# Altium schematic sheet Control Board 2.SchDoc
size A4; SheetNumber: 1; SheetTotal: 2
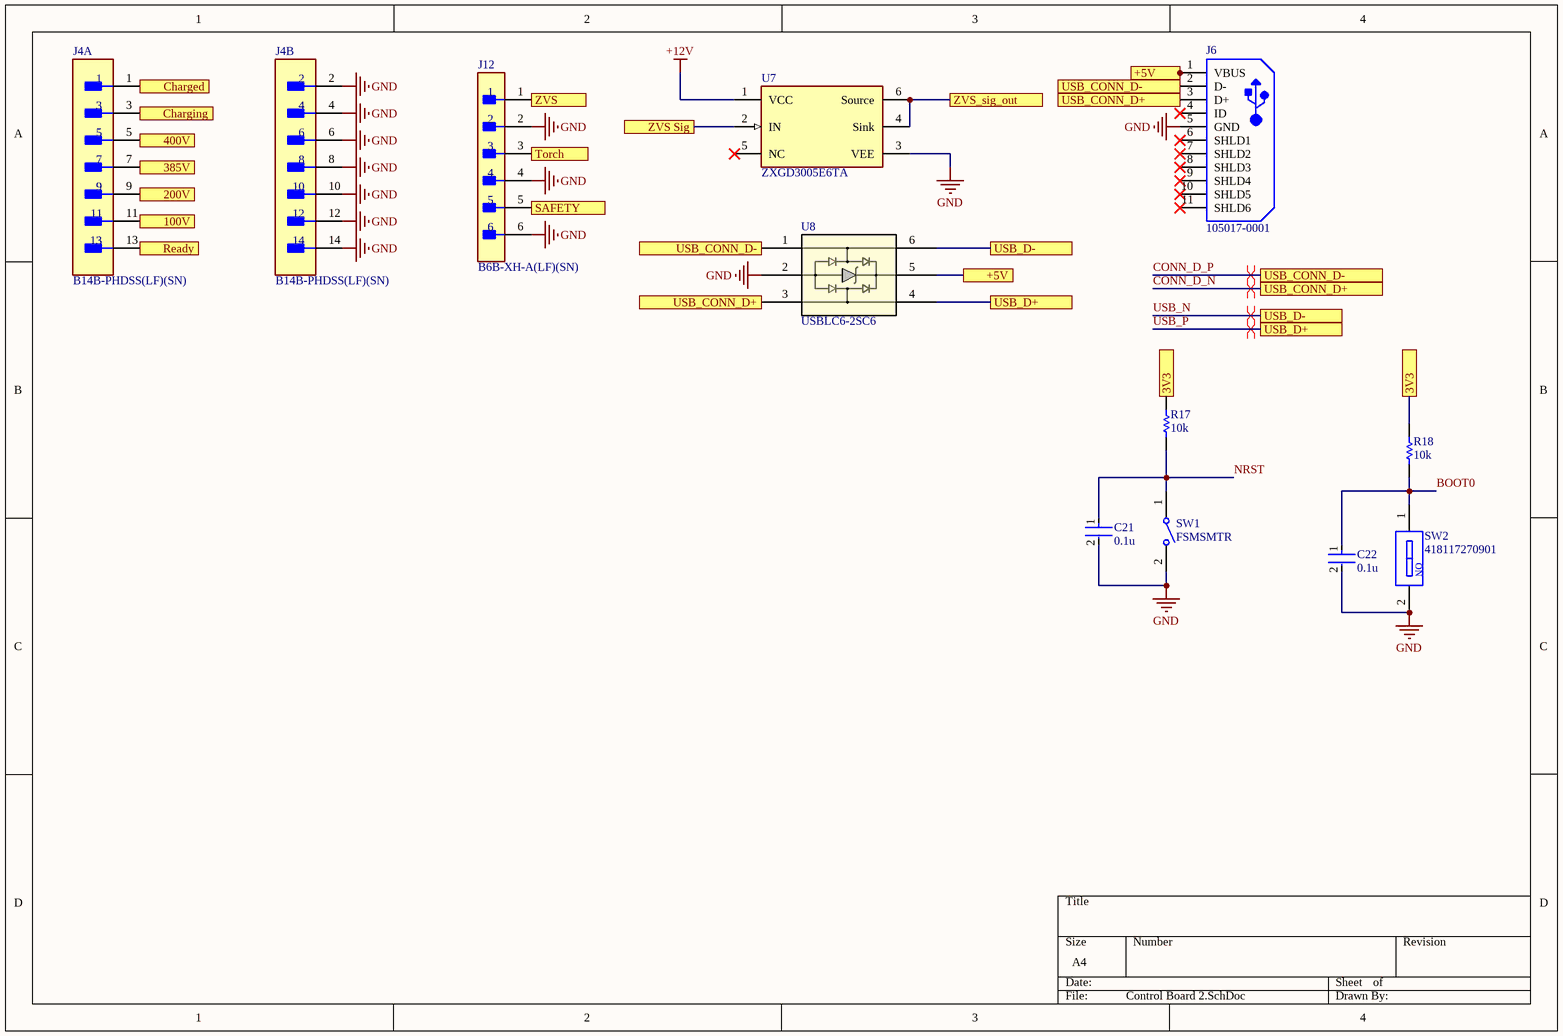
[diagram p0: Control Board 2.SchDoc]

## Parts
C21  0.1u  [FP-GRM188-0_1-e0_2_0_55-IPC_A]
C22  0.1u  [FP-GRM188-0_1-e0_2_0_55-IPC_A]
J4  B14B-PHDSS(LF)(SN)  [FP-B14B-PHDSS_LF_SN-MFG]  (parts A,B of 2)
J6  105017-0001  [USB-MICRO-B_V]
J12  B6B-XH-A(LF)(SN)  [FP-B6B-XH-A_LF_SN-MFG]
R17  10k  [RESC1609X50X30NL8T20]
R18  10k  [RESC1609X50X30NL8T20]
SW1  FSMSMTR  [TECO-FSMSMTR_V]
SW2  418117270901  [418117270901]
U7  ZXGD3005E6TA  [FP-SOT26_SC74R-MFG]
U8  USBLC6-2SC6  [SOT23-6L_STM]

## Ports
3V3, 100V, 200V, 385V, 400V, +5V, Charged, Charging, Ready, SAFETY, Torch, USB_CONN_D+, USB_CONN_D-, USB_D+, USB_D-, ZVS, ZVS Sig, ZVS_sig_out

## Nets
+12V: U7.1(VCC)
GND: C21.2 C22.2 J4.2 J4.4 J4.6 J4.8 J4.10 J4.12 J4.14 J6.5(GND) J12.2 J12.4 J12.6 SW1.2 SW2.2 U7.3(VEE) U8.2
3V3: R17.1 R18.1 ; port 3V3
100V: J4.11 ; port 100V
200V: J4.9 ; port 200V
385V: J4.7 ; port 385V
400V: J4.5 ; port 400V
+5V: J6.1(VBUS) U8.5 ; port +5V
BOOT0: C22.1 R18.2 SW2.1
Charged: J4.1 ; port Charged
Charging: J4.3 ; port Charging
CONN_D_N: J6.3(D+) U8.3 ; port USB_CONN_D+
CONN_D_P: J6.2(D-) U8.1 ; port USB_CONN_D-
NRST: C21.1 R17.2 SW1.1
Ready: J4.13 ; port Ready
SAFETY: J12.5 ; port SAFETY
Torch: J12.3 ; port Torch
USB_N: U8.6 ; port USB_D-
USB_P: U8.4 ; port USB_D+
ZVS: J12.1 ; port ZVS
ZVS Sig: U7.2(IN) ; port ZVS Sig
ZVS_sig_out: U7.4(Sink) U7.6(Source) ; port ZVS_sig_out

Not connected (* = marked no-connect by the designer): J6 4(ID)* 6(SHLD1)* 7(SHLD2)* 8(SHLD3)* 9(SHLD4)* 10(SHLD5)* 11(SHLD6)*; U7 5(NC)*

## Layout directives
differential pair: CONN_D_N, CONN_D_P, USB_N, USB_P

## Notes on the sheet
- (in symbol CMP-1435-00001-2) ON

## Library data of the parts
C21 C22 = CMP-2006-02792-2: Chip Multilayer Ceramic Capacitors for General Purpose, 0603, 10uF, X5R, 15%, 20%, 6.3V; Packaging: Tape and Reel; Voltage Rating (DC): 6.3V; Width: 0.031inch; Termination: SMD/SMT; Dielectric: X5R; Package Quantity: 4000; Voltage Rating: 6.3V; Capacitance: 10uF; Case/Package: 0603; Min Operating Temperature: -55°C; Voltage: 6.3V; Length: 1.6mm; Thickness: 0.035inch; Lead Free: Lead Free; Depth: 0.8mm; Case Code (Imperial): 0603; Max Operating Temperature: 85°C; Material: Ceramic; Height: 0.8mm; Tolerance: 20%; Mount: Surface Mount; REACH SVHC: No SVHC; Radiation Hardening: No; Case Code (Metric): 1608
J4 = CMP-17439-000218-1: CONN HEADER VERT 14POS 2MM; Current Rating: 3A; Gender: Male; Mated Stacking Heights: 8.8mm; Voltage Rating: 250V; Number of Positions: 14; Row Spacing: 0.079inch; Number of Rows: 2; Contact Material: Copper Alloy; Series: PHD; Contact Type: Male Pin; Termination: Solder; Packaging: Bulk; Fastening Type: Detent; Length: 15.9mm; Mount: Through Hole; Insulation Material: Nylon; Contact Plating: Tin; Lead Free: Lead Free; Height: 9.5mm; Housing Material: Nylon; Width: 5mm; Color: Natural; Contact Shape: Square; Flammability Rating: UL94 V-0; Pitch: 2mm; Contact Finish - Mating: TIN; Contact Mating Length: 0.114inch; Insulation Color: Natural; Connector Type: Header; Housing Color: Natural; Number of Contacts: 14
J6 = CMP-2000-05827-1: Micro-USB B Receptacle, Right Angle, Bottom Mount, Surface Mount, with Solder Tabs, -30 to 85 degC, 5-Pin USB, RoHS, Tape and Reel; Manufacturer: Molex; Featured Product: Micro-USBConnectorsUSBConnectors; Other Names: WM1399DKR; Package Version: Rev. F, 12/2012; Number of Contacts: 5; Connector Type: USB-microB; Catalog Drawings: 1050170001; 3D Model: 105017-0001.stp; Mating Products: WM17145-ND-CABLEMICROUSBBTOSTDA1.0MWM17147-ND-CABLEMICROUSBBTOSTDA2.0MWM17146-ND-CABLEMICROUSBBTOSTDA1.5M; PCN Assembly/Origin: ResinSupplier21/Oct/2015; Voltage - Max: 30V; Online Catalog: Molex-MicroUSB; Manufacturer URL: http://www.molex.com/; Package Description: 5-Leads USB, Micro B, Body 7.5 x 5 mm, Pitch 0.65 mm; Datasheet URL: http://www.molex.com/elqNow/elqRedir.htm?ref=http://www.molex.com/webdocs/datasheets/pdf/en-us/1050170001_IO_CONNECTORS.pdf; Ingress Protection: -; Datasheet Version: 03/2016; Mounting Type: BoardCutout,SurfaceMount,RightAngle; Circuits: 5; Standard Package: 1; Package Reference: MICRO-B; Package URL: http://www.molex.com/pdm_docs/sd/1050170001_sd.pdf; Category: Connectors,Interconnects; Series: -; RoHS Information: 1050170001CertofCompliance; Features: Shielded,SolderRetention; Family: USB,DVI,HDMIConnectors; Specifications: -; Gender: Receptacle; Packaging: Digi-Reel®; Mounting Technology: SurfaceMount
J12 = CMP-17439-000076-1: CONN HEADER VERT 6POS 2.5MM
R17 R18 = CMP-1666-00005-4: Chip Resistor, 10 KOhm, +/- 1%, 100 mW, -55 to 155 degC, 0603 (1608 Metric), RoHS, Tape and Reel; Manufacturer: Vishay Semiconductor; Voltage Rating: 75 V; Max Operating Temperature: 155 degC; PackageDescription: 2-Pin Surface Mount Device, Body 1.575 x 0.85 mm; ComponentLink1Description: Manufacturer URL; RoHSCompliant: true; PackageReference: 0603; REACH SVHC: Unknown; Length: 1.55 mm; DatasheetVersion: 06/2012; Packaging: Tape and Reel; Min Operating Temperature: -55 degC; Mounting Technology: Surface Mount; ComponentLink2URL: https://datasheet.ciiva.com/11809/0900766b80d98afc-11809037.pdf; Height: 0.45 mm; ComponentLink2Description: Datasheet; Package Quantity: 5000; ComponentLink1URL: http://www.vishay.com/
SW1 = CMP-2000-07501-1: FSMSM Push Button Switch, 50 mA, -35 to 85 degC, 2-Pin SMD, RoHS, Tape and Reel; Manufacturer: TE Connectivity; Voltage Rating (DC): 24V; Electrical Life: 20000Cycles; Operating Force: 180gf; Switch Travel: 0.25mm; Contact Current Rating: 50mA; Case\/Package: SMD/SMT; Actuator Length: 1.07mm; Throw Configuration: SPST; Actuator Material: Polyamide; Contact Resistance: 100mOhm; Illumination Type: Illuminated; Max Voltage Rating (DC): 12V; Manufacturer URL: http://www.te.com/; Lead Free: LeadFree; Packaging: TapeandReel; Min Operating Temperature: -35degC; Mechanical Life: 20000Cycles; Mount: SurfaceMount; REACH SVHC: Unknown; Package Quantity: 1800; Package Reference: FSMSMTR; RoHSCompliant: true; Max Operating Temperature: 85degC; Orientation: Straight; ELV: Compliant; Datasheet URL: http://www.te.com/commerce/DocumentDelivery/DDEController?Action=showdoc&DocId=Customer+Drawing%7F1437566-3%7FC2%7Fpdf%7FEnglish%7FENG_CD_1437566-3_C2_1437566_3_1_c.dwg.pdf%7F1437566-4; Package Description: 2-Pin Surface Mount Device, Body 6 x 3.5 mm, Pitch 9.19 mm; Current Rating: 50mA; Contact Plating: Silver; Termination: GullWing; Datasheet Version: Rev. C2, 08/2014; Contact Material: Brass; Mounting Technology: SurfaceMount
SW2 = CMP-1435-00001-2: NexarPartId: 22584988; Mechanical Life: 5kcycles; Number of Positions: 1; Life (Cycles): 2kcycles; Insulation Resistance: 100MΩ; Contact Resistance: 50mΩ; Voltage Rating: 24V; Current Rating: 25mA; Body Material: Nylon, Polyamide; Washable: No; Throw Configuration: SPST; Pitch: 2.54mm; Lead Free: Lead Free; Mount: Through Hole; Max Operating Temperature: 85°C; RoHS: Compliant; Number of Pins: 1; Height: 6.95mm; Min Operating Temperature: -40°C; Termination: PC Pin; Number of Circuits: 1; Contact Current Rating: 25mA; Contact Plating: Gold; Electrical Life: 2kcycles; Voltage Rating (DC): 24V; Length: 3.84mm
U7 = CMP-12751-000002-1: IC GATE DRVR LOW-SIDE SOT26; Manufacturer: DIODES INC.; Max Supply Voltage: 25V; Number Of Outputs: 1; Max Power Dissipation: 1.1W; Fall Time: 16ns; Automotive Grade: Grade 0; Output Current: 10A; Rise Time: 8ns; Max Junction Temp: +150°C; Nominal Supply Current: 0.05uA; Standoff Height: 0.013mm; RoHS: TRUE; Temperature Range Low: -55°C; Octopart: https://octopart.com/zxgd3005e6ta-diodes+inc.-19727179; Lead Free: Yes; Device Class L3: Gate Drivers; ComponentLink2URL: https://www.diodes.com/assets/Datasheets/ZXGD3005E6.pdf; Digikey Description: IC GATE DRVR LOW-SIDE SOT26; ComponentLink2Description: Datasheet; Category: IC; Footprint Url: https://www.diodes.com/assets/Package-Files/SOT26-SC74R.pdf; Device Class L1: Integrated Circuits (ICs); Automotive: Yes; Device Class L2: Power Management ICs; Mouser Description: Gate Drivers 10A GATE DRIVER 25V VCC 25V VIN; Manufacturer Part Number: ZXGD3005E6TA; Ipc Land Pattern Name: SOT95P280X115-6; Height: 1.4mm; Temperature Range High: +150°C; Package: SOT26 (SC74R); Number Of Drivers: 1; Temperature: -55°C to +150°C
U8 = USBLC6-2SC6: No Description Available; Mfr_Name: STMicroelectronics; Copyright: Copyright (C) 2023 Ultra Librarian. All rights reserved.; Manufacturer_Part_Number: USBLC6-2SC6; RefDes: RefDes; Type: DEV